# EAGLE board tester (EAGLE 6.6.0)
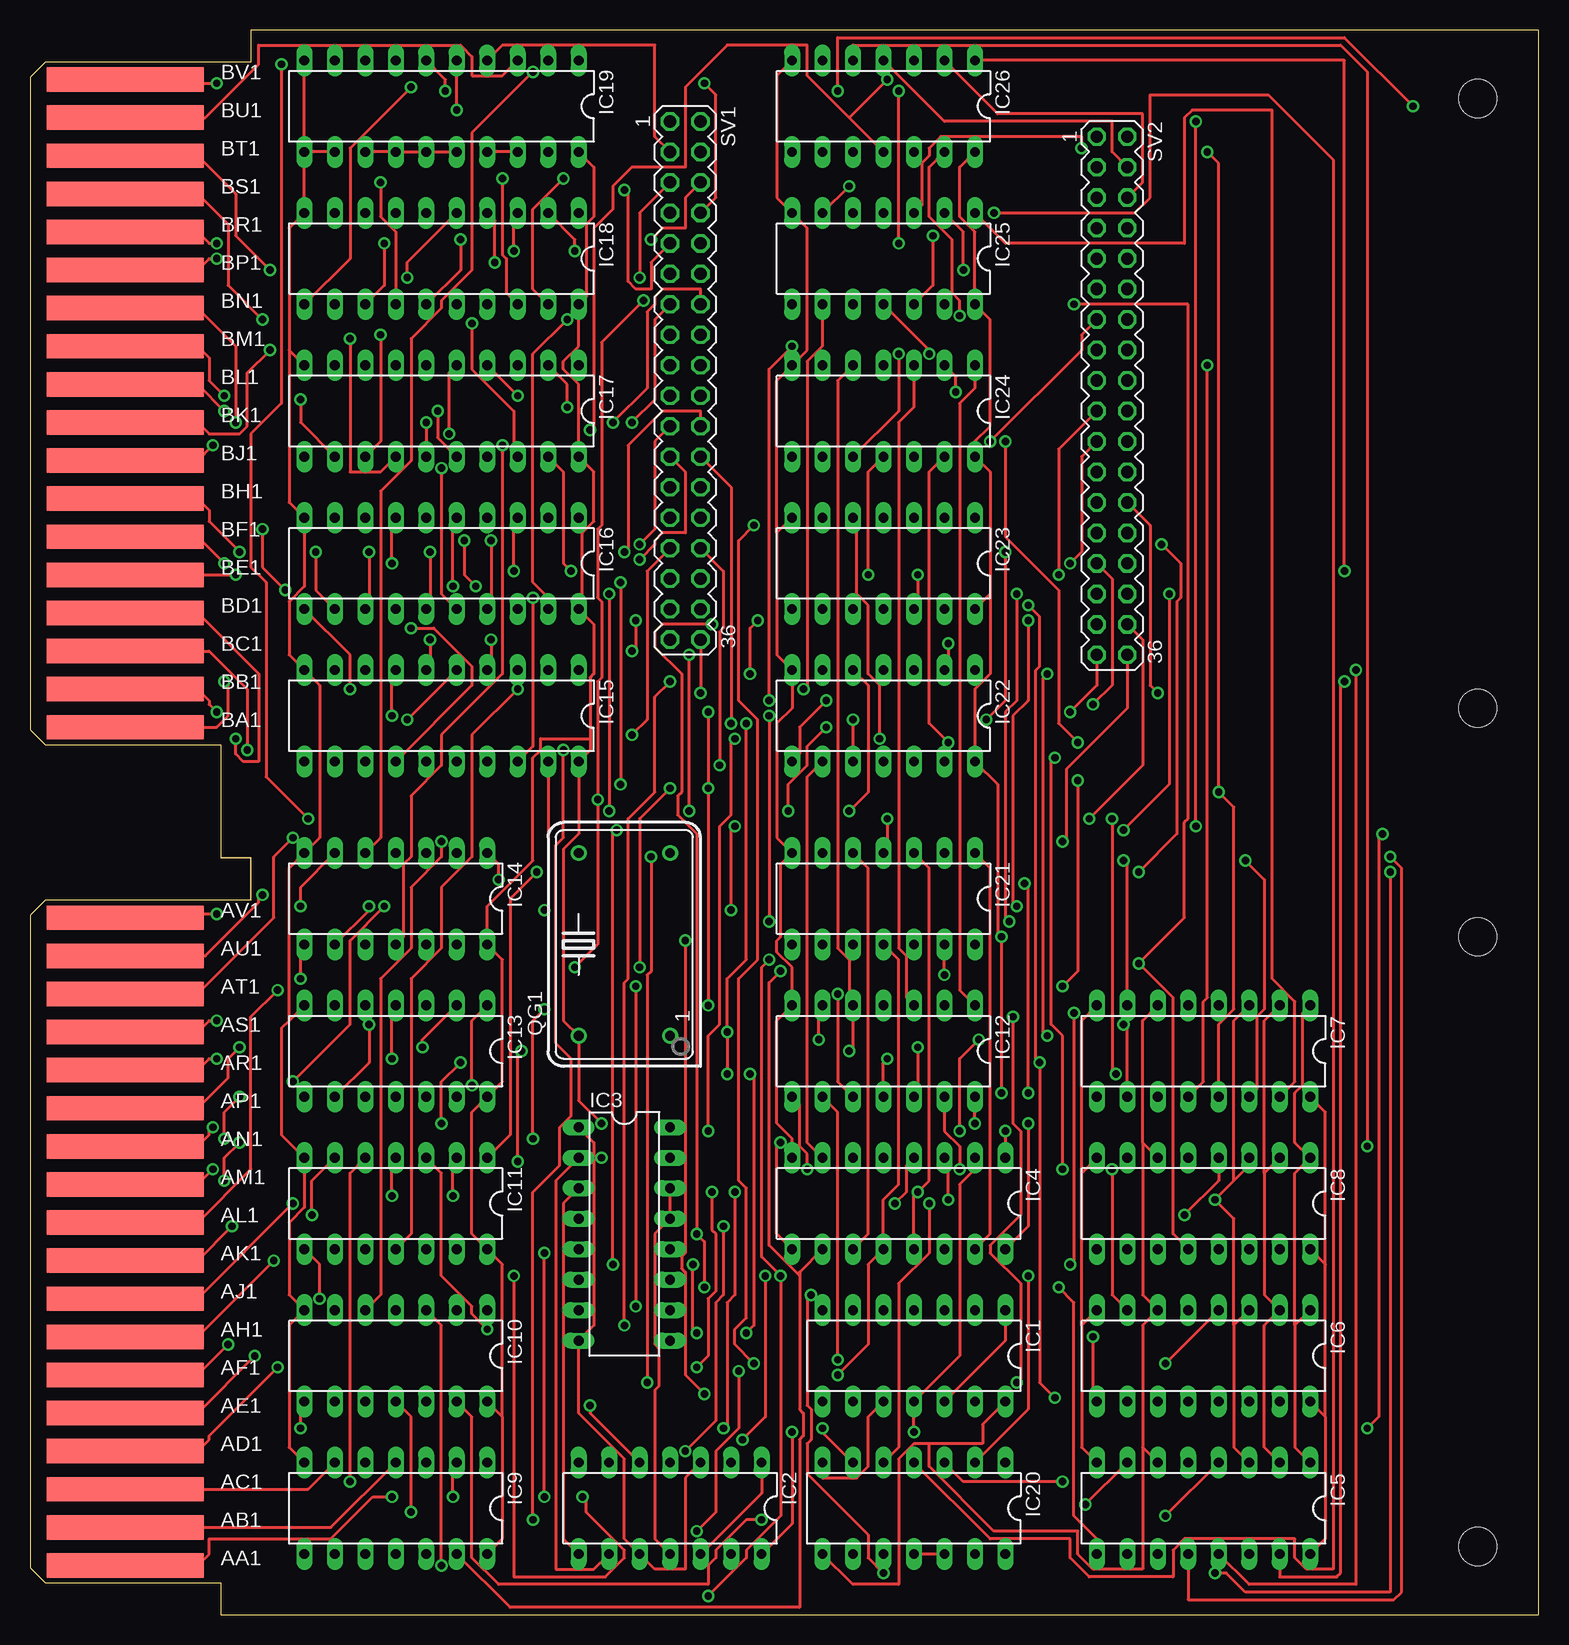
[diagram p1: board, top side]
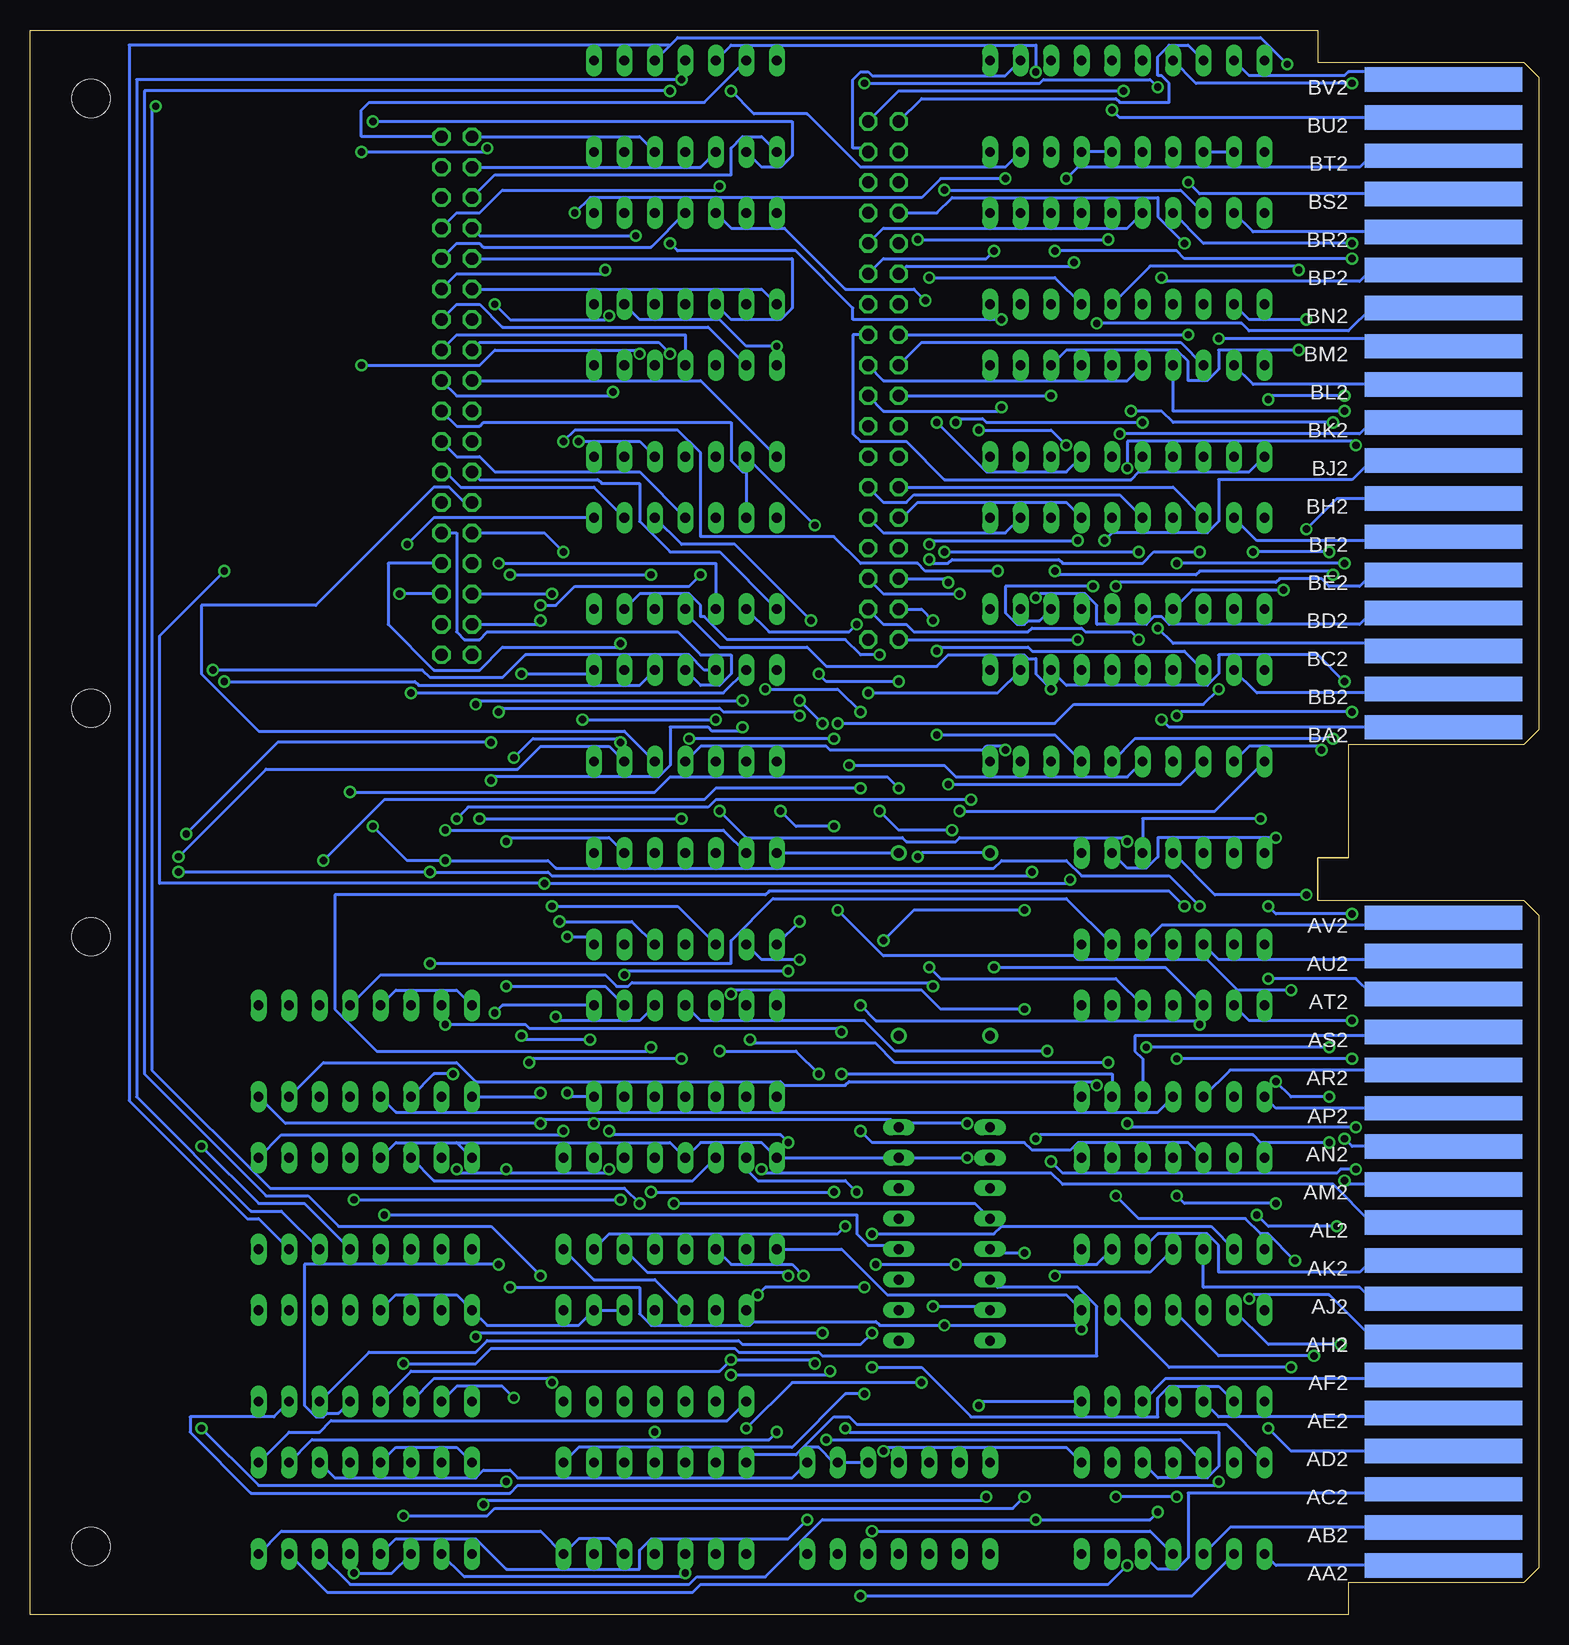
[diagram p2: board, bottom side, seen from below]

Size 125.73 x 132.08 mm. Coordinates in mm from the lower left corner, seen from the top.
Copper layers (1*16): Top 0.035mm / dielectric 1.5mm / Bottom 0.035mm
Design rules "10mils *": minimum track width 10mil, minimum drill 24mil, track to track 10mil, track to pad 10mil, pad to pad 10mil, via to via 10mil, smd to smd 0mil, copper to edge 15mil, drill to drill 10mil, minimum pad ring 10mil, minimum via ring 8mil, stop-mask expansion 0mil, vias tented up to drill 0mil, thermal gap 10mil

## Footprints (pad centres in the part's own frame; a part is rotated, then mirrored left to right if it is on the bottom)
DIL14 = drill 0.813 long: 1 -7.62,-3.81; 2 -5.08,-3.81; 3 -2.54,-3.81; 4 0,-3.81; 5 2.54,-3.81; 6 5.08,-3.81; 7 7.62,-3.81; 8 7.62,3.81; 9 5.08,3.81; 10 2.54,3.81; 11 0,3.81; 12 -2.54,3.81; 13 -5.08,3.81; 14 -7.62,3.81
DIL16 = drill 0.813 long: 1 -8.89,-3.81; 2 -6.35,-3.81; 3 -3.81,-3.81; 4 -1.27,-3.81; 5 1.27,-3.81; 6 3.81,-3.81; 7 6.35,-3.81; 8 8.89,-3.81; 9 8.89,3.81; 10 6.35,3.81; 11 3.81,3.81; 12 1.27,3.81; 13 -1.27,3.81; 14 -3.81,3.81; 15 -6.35,3.81; 16 -8.89,3.81
DIL20 = drill 0.813 long: 1 -11.43,-3.81; 2 -8.89,-3.81; 3 -6.35,-3.81; 4 -3.81,-3.81; 5 -1.27,-3.81; 6 1.27,-3.81; 7 3.81,-3.81; 8 6.35,-3.81; 9 8.89,-3.81; 10 11.43,-3.81; 11 11.43,3.81; 12 8.89,3.81; 13 6.35,3.81; 14 3.81,3.81; 15 1.27,3.81; 16 -1.27,3.81; 17 -3.81,3.81; 18 -6.35,3.81; 19 -8.89,3.81; 20 -11.43,3.81
DIL14S = drill 0.813: 1 -7.62,-3.81; 7 7.62,-3.81; 8 7.62,3.81; 14 -7.62,3.81
MA18-2 = drill 1.016 octagon: 1 -21.59,-1.27; 2 -21.59,1.27; 3 -19.05,-1.27; 4 -19.05,1.27; 5 -16.51,-1.27; 6 -16.51,1.27; 7 -13.97,-1.27; 8 -13.97,1.27; 9 -11.43,-1.27; 10 -11.43,1.27; 11 -8.89,-1.27; 12 -8.89,1.27; 13 -6.35,-1.27; 14 -6.35,1.27; 15 -3.81,-1.27; 16 -3.81,1.27; 17 -1.27,-1.27; 18 -1.27,1.27; 19 1.27,-1.27; 20 1.27,1.27; 21 3.81,-1.27; 22 3.81,1.27; 23 6.35,-1.27; 24 6.35,1.27; 25 8.89,-1.27; 26 8.89,1.27; 27 11.43,-1.27; 28 11.43,1.27; 29 13.97,-1.27; 30 13.97,1.27; 31 16.51,-1.27; 32 16.51,1.27; 33 19.05,-1.27; 34 19.05,1.27; 35 21.59,-1.27; 36 21.59,1.27
EDGE-CON4 = smd 13.106 x 2.032: AA1 7.938,4.128; AB1 7.938,7.303; AC1 7.938,10.477; AD1 7.938,13.652; AE1 7.938,16.828; AF1 7.938,20.003; AH1 7.938,23.177; AJ1 7.938,26.352; AK1 7.938,29.527; AL1 7.938,32.703; AM1 7.938,35.877; AN1 7.938,39.053; AP1 7.938,42.227; AR1 7.938,45.403; AS1 7.938,48.578; AT1 7.938,51.752; AU1 7.938,54.928; AV1 7.938,58.102; BA1 7.938,73.978; BB1 7.938,77.153; BC1 7.938,80.328; BD1 7.938,83.502; BE1 7.938,86.677; BF1 7.938,89.853; BH1 7.938,93.028; BJ1 7.938,96.203; BK1 7.938,99.377; BL1 7.938,102.552; BM1 7.938,105.728; BN1 7.938,108.903; BP1 7.938,112.078; BR1 7.938,115.252; BS1 7.938,118.427; BT1 7.938,121.603; BU1 7.938,124.778; BV1 7.938,127.953 | smd 13.106 x 2.032 bottom: AA2 7.938,4.128; AB2 7.938,7.303; AC2 7.938,10.477; AD2 7.938,13.652; AE2 7.938,16.828; AF2 7.938,20.003; AH2 7.938,23.177; AJ2 7.938,26.352; AK2 7.938,29.527; AL2 7.938,32.703; AM2 7.938,35.877; AN2 7.938,39.053; AP2 7.938,42.227; AR2 7.938,45.403; AS2 7.938,48.578; AT2 7.938,51.752; AU2 7.938,54.928; AV2 7.938,58.102; BA2 7.938,73.978; BB2 7.938,77.153; BC2 7.938,80.328; BD2 7.938,83.502; BE2 7.938,86.677; BF2 7.938,89.853; BH2 7.938,93.028; BJ2 7.938,96.203; BK2 7.938,99.377; BL2 7.938,102.552; BM2 7.938,105.728; BN2 7.938,108.903; BP2 7.938,112.078; BR2 7.938,115.252; BS2 7.938,118.427; BT2 7.938,121.603; BU2 7.938,124.778; BV2 7.938,127.953
DOUBLE = hole 3.175: 120.65,56.515; 120.65,5.715; 120.65,75.565; 120.65,126.365

## Placement (x,y rotation side)
IC1  74LS93N  [DIL14]  73.66,21.59 180 top
IC2  74LS93N  [DIL14]  53.34,8.89 180 top
IC3  74LS139N  [DIL16]  49.53,31.75 270 top
IC4  74LS138N  [DIL16]  72.39,34.29 180 top
IC5  74LS138N  [DIL16]  97.79,8.89 180 top
IC6  74LS138N  [DIL16]  97.79,21.59 180 top
IC7  74LS138N  [DIL16]  97.79,46.99 180 top
IC8  74LS138N  [DIL16]  97.79,34.29 180 top
IC9  74LS07N  [DIL14]  30.48,8.89 180 top
IC10  74LS07N  [DIL14]  30.48,21.59 180 top
IC11  74LS07N  [DIL14]  30.48,34.29 180 top
IC12  74LS07N  [DIL14]  71.12,46.99 180 top
IC13  74LS07N  [DIL14]  30.48,46.99 180 top
IC14  74LS07N  [DIL14]  30.48,59.69 180 top
IC15  74LS682N  [DIL20]  34.29,74.93 180 top
IC16  74LS682N  [DIL20]  34.29,87.63 180 top
IC17  74LS682N  [DIL20]  34.29,100.33 180 top
IC18  74LS682N  [DIL20]  34.29,113.03 180 top
IC19  74LS682N  [DIL20]  34.29,125.73 180 top
IC20  74LS30N  [DIL14]  73.66,8.89 180 top
IC21  74LS07N  [DIL14]  71.12,59.69 180 top
IC22  74LS07N  [DIL14]  71.12,74.93 180 top
IC23  74LS07N  [DIL14]  71.12,87.63 180 top
IC24  74LS07N  [DIL14]  71.12,100.33 180 top
IC25  74LS07N  [DIL14]  71.12,113.03 180 top
IC26  74LS07N  [DIL14]  71.12,125.73 180 top
QG1  [DIL14S]  49.53,55.88 90 top
SV1  [MA18-2]  54.61,102.87 270 top
SV2  [MA18-2]  90.17,101.6 270 top
U$1  [EDGE-CON4]  0,0 0 top
U$2  OUTLINE-DOUBLE  [DOUBLE]  0,0 0 top

## Tracks (layer width: path | path; a pad name or v marks a point on that pad's centre or on a via)
A1  (via drill 0.61)
  Top 0.254: v54.61,13.65 57.15,16.19 57.15,26.04 57.79,26.67 v57.79,32.38 | IC21.1 80.01,62.23 80.01,31.75 IC4.15
  Bottom 0.254: IC9.1 39.37,13.97 54.29,13.97 v54.61,13.65 | v57.79,32.38 58.42,31.75 77.47,31.75 IC4.15
A2  (via drill 0.61)
  Top 0.254: v56.52,1.59 59.69,4.76 59.69,5.4 62.55,8.26 v62.55,28.26 60.96,29.84 60.96,53.98 v61.6,54.61
  Bottom 0.254: IC9.9 28.89,1.59 v56.52,1.59 | v62.55,28.26 62.87,28.57 74.3,28.57 IC4.14 | IC21.9 64.77,54.61 v61.6,54.61
AA1  (via drill 0.61)
  Top 0.254: IC9.2 35.24,12.38 v35.24,9.84 | v30.16,9.84 28.58,9.84 25.08,6.35 14.92,6.35 14.92,5.08 13.97,4.13 U$1.AA1
  Bottom 0.254: v30.16,9.84 v35.24,9.84
AA2
  Bottom 0.254: IC9.8 21.91,4.13 U$1.AA2
AB1
  Top 0.254: IC9.4 25.08,7.3 U$1.AB1
AB2
  Bottom 0.254: IC9.10 25.72,7.3 U$1.AB2
AC1
  Top 0.254: IC9.6 23.18,10.48 U$1.AC1
AC2
  Bottom 0.254: IC9.12 31.75,3.81 30.16,3.81 29.21,4.76 29.21,10.16 8.26,10.16 U$1.AC2
AD1  (via drill 0.61)
  Top 0.254: v20.64,20.64 14.92,14.92 14.92,14.61 13.97,13.65 U$1.AD1
  Bottom 0.254: IC10.2 30.8,20.64 v20.64,20.64
AD2  (via drill 0.61)
  Top 0.254: IC10.8 22.54,17.46 v22.54,15.56
  Bottom 0.254: v22.54,15.56 20.64,13.65 U$1.AD2
ADD0  (via drill 0.61)
  Top 0.254: v81.28,40.32 IC4.1 | IC7.1 106.05,50.16 106.05,44.13 105.41,43.5 105.41,39.37 IC8.1 105.41,36.83 105.41,24.13 | IC5.1 105.41,13.97 105.41,24.13 | IC6.1 105.41,24.13
  Bottom 0.254: v81.28,40.32 81.6,40.01 104.78,40.01 IC8.1 | IC1.8 67.63,16.19 100.65,16.19 101.6,15.24 104.14,15.24 IC5.1
ADD1  (via drill 0.61)
  Top 0.254: 102.87,36.83 102.87,26.67 IC6.2 102.87,24.13 102.87,13.97 IC5.2 | IC8.2 102.87,36.83 | IC7.2 102.87,49.53 102.87,36.83 | IC4.2 78.74,37.15 77.47,35.88 77.47,21.59 IC1.11 v73.66,15.24 | IC2.14 63.5,7.62 v63.5,15.24
  Bottom 0.254: v63.5,15.24 64.14,14.61 73.66,14.61 | 73.66,14.61 102.24,14.61 IC5.2 | 73.66,14.61 v73.66,15.24
ADD2  (via drill 0.61)
  Top 0.254: IC4.3 76.52,37.78 v76.52,34.61 | 100.33,36.2 101.6,37.47 IC8.3 | 100.33,36.2 v98.74,34.61 100.33,33.02 100.33,24.13 | IC7.3 100.33,49.53 100.33,36.2 | IC2.12 60.96,10.16 IC2.1 | IC5.3 100.33,13.97 100.33,24.13 | IC6.3 100.33,24.13
  Bottom 0.254: v98.74,34.61 v76.52,34.61 | IC2.1 62.23,11.43 85.09,11.43 85.73,12.06 87.95,12.06 88.58,11.43 100.33,11.43 IC5.3
ADD3
  Top 0.254: IC2.9 46.99,3.81 43.82,3.81 43.82,36.2 IC3.2
ADD4
  Top 0.254: IC2.8 44.45,6.35 44.45,34.29 IC3.3
ADD5
  Top 0.254: IC2.11 52.07,6.35 52.07,18.73 52.39,19.05 52.39,22.23 52.07,22.54 52.07,31.75 IC3.13 IC3.14
AE1  (via drill 0.61)
  Top 0.254: v18.73,21.59 13.97,16.83 U$1.AE1
  Bottom 0.254: IC10.4 26.67,21.59 v18.73,21.59
AE2
  Bottom 0.254: IC10.10 26.67,16.51 8.26,16.51 U$1.AE2
AF1  (via drill 0.61)
  Top 0.254: v16.51,22.54 13.97,20 U$1.AF1
  Bottom 0.254: IC10.6 22.54,22.54 v16.51,22.54
AF2
  Bottom 0.254: IC10.12 31.12,19.68 8.26,19.68 U$1.AF2
AH1  (via drill 0.61)
  Top 0.254: IC11.2 35.24,37.78 v35.24,34.92 | v20.32,29.53 13.97,23.18 U$1.AH1
  Bottom 0.254: v35.24,34.92 33.34,33.02 24.45,33.02 23.18,31.75 22.54,31.75 v20.32,29.53
AH2  (via drill 0.61)
  Top 0.254: IC11.8 24.13,29.21 v24.13,26.35
  Bottom 0.254: v24.13,26.35 23.81,26.67 17.46,26.67 13.97,23.18 U$1.AH2
AJ1  (via drill 0.61)
  Top 0.254: IC11.4 30.16,37.78 v30.16,34.92 | v21.91,34.29 13.97,26.35 U$1.AJ1
  Bottom 0.254: v30.16,34.92 29.53,34.29 v21.91,34.29
AJ2
  Bottom 0.254: IC11.10 27.94,27.3 14.92,27.3 13.97,26.35 U$1.AJ2
AK1  (via drill 0.61)
  Top 0.254: IC11.6 23.5,36.2 v23.5,33.34 | v16.83,32.38 13.97,29.53 U$1.AK1
  Bottom 0.254: v23.5,33.34 22.54,32.38 v16.83,32.38
AK2
  Bottom 0.254: IC11.12 31.75,31.75 27.62,31.75 26.67,30.8 26.67,28.57 14.92,28.57 13.97,29.53 U$1.AK2
AL1  (via drill 0.61)
  Top 0.254: v86.04,52.39 87.31,53.66 v87.31,69.53 | v66.36,73.98 64.77,72.39 64.77,70.8 63.18,69.22 v63.18,66.99 | v58.74,65.72 58.42,65.41 v58.42,58.74 | v20.64,52.07 18.42,49.85 18.42,37.15 13.97,32.7 U$1.AL1
  Bottom 0.254: IC12.2 77.79,52.39 v86.04,52.39 | v87.31,69.53 87,69.85 73.34,69.85 72.39,70.8 72.39,73.98 69.22,73.98 68.9,73.66 66.68,73.66 v66.36,73.98 | v63.18,66.99 61.91,65.72 v58.74,65.72 | v58.42,58.74 54.61,54.93 38.74,54.93 38.42,54.61 27.62,54.61 25.08,52.07 v20.64,52.07
AL2  (via drill 0.61)
  Top 0.254: IC12.8 64.14,42.55 64.14,39.05 64.77,38.42 v64.77,37.15
  Bottom 0.254: v64.77,37.15 64.45,36.83 40.64,36.83 39.69,35.88 17.15,35.88 13.97,32.7 U$1.AL2
AM1  (via drill 0.61)
  Top 0.254: v40.96,46.99 40.64,46.67 v40.64,37.78 | v15.24,37.15 13.97,35.88 U$1.AM1
  Bottom 0.254: IC12.4 69.85,49.53 56.2,49.53 53.66,46.99 v40.96,46.99 | v40.64,37.78 39.69,36.83 16.83,36.83 16.51,37.15 v15.24,37.15
AM2  (via drill 0.61)
  Top 0.254: IC12.10 67.31,44.45 v67.31,51.75 | v42.86,50.48 41.91,49.53 v41.91,39.69 | v17.46,39.37 16.19,38.1 v16.19,36.2
  Bottom 0.254: v67.31,51.75 66.99,52.07 51.44,52.07 49.85,50.48 v42.86,50.48 | v41.91,39.69 41.59,40.01 23.81,40.01 23.18,39.37 v17.46,39.37 | v16.19,36.2 15.88,35.88 U$1.AM2
AN1  (via drill 0.61)
  Top 0.254: IC12.6 65.72,50.48 v65.72,47.94 | v35.88,46.04 34.29,44.45 v34.29,40.96 | v15.24,40.64 14.92,40.32 14.92,40.01 13.97,39.05 U$1.AN1
  Bottom 0.254: v65.72,47.94 65.41,47.62 55.25,47.62 53.66,46.04 v35.88,46.04 | v34.29,40.96 33.97,40.64 v15.24,40.64
AN2  (via drill 0.61)
  Top 0.254: IC12.12 73.98,43.5 v73.98,47.31 | v29.53,59.05 26.67,56.2 26.67,49.21 v21.91,44.45 | v17.46,43.18 16.19,41.91 v16.19,39.69
  Bottom 0.254: v73.98,47.31 74.3,46.99 96.84,46.99 100.33,50.48 100.33,60.01 64.45,60.01 64.14,60.33 30.8,60.33 v29.53,59.05 | v21.91,44.45 20.64,43.18 v17.46,43.18 | v16.19,39.69 15.56,39.05 U$1.AN2
AP1  (via drill 0.61)
  Top 0.254: IC13.2 32.7,47.94 v32.7,47.31 | v17.46,47.31 16.51,46.35 16.51,44.77 13.97,42.23 U$1.AP1
  Bottom 0.254: v17.46,47.31 v32.7,47.31
AP2
  Bottom 0.254: IC13.8 21.91,42.23 U$1.AP2
AR1  (via drill 0.61)
  Top 0.254: IC13.4 30.16,50.48 v30.16,46.35 | v15.56,46.35 14.92,46.35 13.97,45.4 U$1.AR1
  Bottom 0.254: v15.56,46.35 v30.16,46.35
AR2
  Bottom 0.254: IC13.10 25.72,45.4 U$1.AR2
AS1  (via drill 0.61)
  Top 0.254: v15.56,49.53 14.92,49.53 13.97,48.58 U$1.AS1
  Bottom 0.254: IC13.6 24.13,49.53 v15.56,49.53
AS2
  Bottom 0.254: IC13.12 33.02,46.35 33.66,46.99 33.66,48.26 8.26,48.26 U$1.AS2
AT1  (via drill 0.61)
  Top 0.254: v21.91,64.77 20.32,63.18 20.32,58.1 13.97,51.75 U$1.AT1
  Bottom 0.254: IC14.2 34.29,62.23 32.7,62.23 31.75,63.18 31.75,64.77 v21.91,64.77
AT2  (via drill 0.61)
  Top 0.254: IC14.8 22.54,55.56 v22.54,53.02
  Bottom 0.254: v22.54,53.02 15.24,53.02 13.97,51.75 U$1.AT2
AU1  (via drill 0.61)
  Top 0.254: v19.37,60.01 19.05,59.69 19.05,59.37 14.61,54.93 U$1.AU1
  Bottom 0.254: IC14.4 26.99,60.01 v19.37,60.01
AU2
  Bottom 0.254: IC14.10 26.67,54.61 8.26,54.61 U$1.AU2
AV1  (via drill 0.61)
  Top 0.254: IC14.6 22.54,60.64 v22.54,59.05 | v15.56,58.42 7.94,58.42 U$1.AV1
  Bottom 0.254: v22.54,59.05 21.91,58.42 v15.56,58.42
AV2
  Bottom 0.254: IC14.12 31.43,57.47 8.57,57.47 U$1.AV2
B1  (via drill 0.61)
  Top 0.254: v57.79,15.56 58.1,15.88 58.1,26.04 58.74,26.67 v58.74,35.24 | IC4.13 73.66,34.92 v73.98,35.24 74.93,36.2 74.93,62.23 IC21.3
  Bottom 0.254: IC9.3 31.75,11.43 27.62,11.43 26.67,12.38 26.67,15.24 57.47,15.24 v57.79,15.56 | v73.98,35.24 v58.74,35.24
B2  (via drill 0.61)
  Top 0.254: v55.56,6.99 57.15,8.57 57.15,13.65 59.06,15.56 v59.06,20.32 | v67.31,20 69.85,22.54 69.85,29.21 IC4.12 71.12,34.61 72.39,35.88 72.39,54.61 IC21.11
  Bottom 0.254: IC9.11 32.39,6.99 v55.56,6.99 | v59.06,20.32 59.37,20 v67.31,20
BA1  (via drill 0.61)
  Top 0.254: v16.19,77.79 16.51,77.47 16.51,74.93 15.56,73.98 U$1.BA1
  Bottom 0.254: IC15.3 39.37,77.47 27.62,77.47 26.67,78.42 26.67,80.01 18.42,80.01 v16.19,77.79
BA2  (via drill 0.61)
  Top 0.254: v31.43,74.61 IC15.5
  Bottom 0.254: v31.43,74.61 30.8,73.98 U$1.BA2
BB1  (via drill 0.61)
  Top 0.254: IC15.7 30.16,78.42 v30.16,74.93 | v15.56,75.25 14.92,75.88 14.92,76.2 13.97,77.15 U$1.BB1
  Bottom 0.254: v30.16,74.93 29.85,75.25 v15.56,75.25
BB2
  Bottom 0.254: IC15.9 23.5,76.83 8.26,76.83 U$1.BB2
BC1  (via drill 0.61)
  Top 0.254: v18.1,72.07 18.1,77.15 14.92,80.33 U$1.BC1
  Bottom 0.254: IC15.12 24.13,72.39 18.42,72.39 v18.1,72.07
BC2  (via drill 0.61)
  Top 0.254: IC15.14 36.83,77.47 36.83,79.06 33.66,82.23 v31.75,82.23
  Bottom 0.254: v31.75,82.23 30.48,80.96 8.57,80.96 U$1.BC2
BD1  (via drill 0.61)
  Top 0.254: v17.15,73.03 17.15,71.75 17.78,71.12 19.05,71.12 19.05,78.42 13.97,83.5 U$1.BD1
  Bottom 0.254: IC15.16 33.66,73.03 v17.15,73.03
BD2  (via drill 0.61)
  Top 0.254: IC15.18 41.91,72.39 v41.91,84.77
  Bottom 0.254: v41.91,84.77 41.59,85.09 37.78,85.09 36.83,84.14 36.83,82.55 32.7,82.55 32.07,83.19 31.43,83.19 30.8,82.55 14.92,82.55 13.97,83.5 U$1.BD2
BE1  (via drill 0.61)
  Top 0.254: IC16.3 40.32,91.12 v40.32,87 | U$1.BE1 v17.15,86.68
  Bottom 0.254: v40.32,87 40.01,86.68 28.58,86.68 28.26,87 17.46,87 v17.15,86.68
BE2  (via drill 0.61)
  Top 0.254: IC16.5 35.24,91.12 v35.24,85.72
  Bottom 0.254: v35.24,85.72 34.93,86.04 21.91,86.04 21.59,86.36 18.1,86.36 17.46,85.72 14.92,85.72 13.97,86.68 U$1.BE2
BF1  (via drill 0.61)
  Top 0.254: IC16.7 30.16,91.12 v30.16,87.63 | v16.19,87.63 13.97,89.85 U$1.BF1
  Bottom 0.254: v16.19,87.63 v30.16,87.63
BF2
  Bottom 0.254: IC16.9 23.5,89.53 8.26,89.53 U$1.BF2
BH1  (via drill 0.61)
  Top 0.254: IC16.12 23.81,85.41 v23.81,88.58 | v17.46,88.58 14.92,91.12 14.92,92.08 13.97,93.03 U$1.BH1
  Bottom 0.254: v17.46,88.58 v23.81,88.58
BH2  (via drill 0.61)
  Top 0.254: v21.27,85.41 19.37,87.31 v19.37,90.49
  Bottom 0.254: IC16.14 28.89,85.41 v21.27,85.41 | v19.37,90.49 16.83,93.03 U$1.BH2
BJ1  (via drill 0.61)
  Top 0.254: IC16.16 34.29,85.09 v34.29,95.57 | v15.24,97.47 13.97,96.2 U$1.BJ1
  Bottom 0.254: v34.29,95.57 34.29,97.79 15.56,97.79 v15.24,97.47
BJ2  (via drill 0.61)
  Top 0.254: v37.15,85.72 36.2,86.68 v36.2,89.53
  Bottom 0.254: IC16.18 41.59,82.87 42.55,82.87 42.86,82.55 43.5,82.55 44.45,83.5 44.45,85.72 v37.15,85.72 | v36.2,89.53 35.56,90.17 27.62,90.17 26.67,91.12 26.67,94.61 15.56,94.61 13.97,96.2 U$1.BJ2
BK1  (via drill 0.61)
  Top 0.254: v20,105.41 18.1,103.5 18.1,99.06 17.46,98.42 14.92,98.42 13.97,99.38 U$1.BK1
  Bottom 0.254: IC17.3 39.37,105.41 30.16,105.41 29.21,104.46 29.21,102.87 27.62,102.87 26.67,103.82 26.67,105.41 v20,105.41
BK2  (via drill 0.61)
  Top 0.254: IC17.5 34.93,103.5 v34.93,98.42
  Bottom 0.254: v34.93,98.42 14.92,98.42 13.97,99.38 U$1.BK2
BL1  (via drill 0.61)
  Top 0.254: v16.19,100.33 13.97,102.55 U$1.BL1
  Bottom 0.254: IC17.7 30.48,100.33 v16.19,100.33
BL2
  Bottom 0.254: IC17.9 23.81,102.55 U$1.BL2
BM1  (via drill 0.61)
  Top 0.254: IC17.12 22.54,99.38 v22.54,101.28 | v16.19,101.6 14.92,102.87 14.92,104.78 13.97,105.73 U$1.BM1
  Bottom 0.254: v22.54,101.28 22.23,101.6 v16.19,101.6
BM2  (via drill 0.61)
  Top 0.254: IC17.14 29.21,95.25 26.67,95.25 v26.67,106.36
  Bottom 0.254: v26.67,106.36 8.57,106.36 U$1.BM2
BN1  (via drill 0.61)
  Top 0.254: IC17.16 33.97,98.11 v33.97,100.33 | v17.15,99.38 17.15,105.73 13.97,108.9 U$1.BN1
  Bottom 0.254: v33.97,100.33 31.43,100.33 30.48,99.38 v17.15,99.38
BN2  (via drill 0.61)
  Top 0.254: IC17.18 40.32,96.84 40.32,100.33 36.83,103.82 v36.83,107.63
  Bottom 0.254: v36.83,107.63 24.77,107.63 24.13,107 15.88,107 13.97,108.9 U$1.BN2
BP1  (via drill 0.61)
  Top 0.254: IC18.3 40.32,116.52 v40.32,113.67 | v15.56,113.03 14.92,113.03 13.97,112.08 U$1.BP1
  Bottom 0.254: v40.32,113.67 30.16,113.67 29.53,113.03 v15.56,113.03
BP2  (via drill 0.61)
  Top 0.254: IC18.5 31.43,112.71 v31.43,111.44
  Bottom 0.254: v31.43,111.44 31.12,111.12 14.92,111.12 13.97,112.08 U$1.BP2
BR1  (via drill 0.61)
  Top 0.254: v15.56,114.3 14.92,114.3 13.97,115.25 U$1.BR1
  Bottom 0.254: IC18.7 27.94,114.3 v15.56,114.3
BR2
  Bottom 0.254: IC18.9 23.81,115.25 U$1.BR2
BS1  (via drill 0.61)
  Top 0.254: v19.37,107.95 16.51,110.81 16.51,115.89 13.97,118.43 U$1.BS1
  Bottom 0.254: IC18.12 24.13,107.95 v19.37,107.95
BS2  (via drill 0.61)
  Top 0.254: IC18.14 30.48,115.25 29.21,116.52 v29.21,119.38
  Bottom 0.254: v29.21,119.38 28.26,118.43 U$1.BS2
BT1  (via drill 0.61)
  Top 0.254: v20,112.08 17.15,114.94 17.15,118.43 13.97,121.6 U$1.BT1
  Bottom 0.254: IC18.16 32.39,112.39 20.32,112.39 v20,112.08
BT2  (via drill 0.61)
  Top 0.254: IC18.18 39.69,110.17 39.69,113.03 39.37,113.35 v39.37,119.7
  Bottom 0.254: v39.37,119.7 38.42,120.65 14.92,120.65 13.97,121.6 U$1.BT2
BU1
  Top 0.254: IC19.3 39.37,128.27 36.83,128.27 36.83,129.86 35.88,130.81 19.05,130.81 19.05,129.22 14.61,124.78 U$1.BU1
BU2  (via drill 0.61)
  Top 0.254: v35.56,125.41 IC19.5
  Bottom 0.254: v35.56,125.41 34.93,124.78 U$1.BU2
BV1  (via drill 0.61)
  Top 0.254: v15.56,127.64 7.94,127.64 U$1.BV1
  Bottom 0.254: IC19.7 28.58,127.64 v15.56,127.64
BV2
  Bottom 0.254: IC19.9 24.13,128.27 16.19,128.27 15.88,128.59 8.57,128.59 U$1.BV2
C1  (via drill 0.61)
  Top 0.254: v59.37,14.61 61.28,16.51 v61.28,28.26 | IC21.5 69.85,62.23 69.85,31.75 IC4.11
  Bottom 0.254: IC9.5 29.85,14.61 v59.37,14.61 | v61.28,28.26 62.23,29.21 67.31,29.21 IC4.11
C2  (via drill 0.61)
  Top 0.254: IC9.13 40.01,0.64 64.14,0.64 64.14,14.61 64.45,14.92 64.45,16.83 64.14,17.14 64.14,28.26 | 64.14,28.26 64.14,28.57 IC4.10 | v76.2,53.34 IC21.13 | v62.55,53.66 61.6,52.7 61.6,30.8 64.14,28.26
  Bottom 0.254: v76.2,53.34 75.88,53.66 v62.55,53.66
CLK1
  Top 0.254: IC1.12 81.28,22.86 IC1.1
D1  (via drill 0.61)
  Top 0.254: v84.77,78.42 84.46,78.11 84.46,48.58 v84.77,48.26 | v79.06,47.94 77.47,46.35 v77.47,40.32 | v62.55,39.37 62.23,39.05 62.23,31.75 IC4.9
  Bottom 0.254: IC10.1 39.37,26.67 54.29,26.67 58.1,30.48 IC4.9 | IC22.1 79.06,78.42 v84.77,78.42 | v84.77,48.26 84.46,47.94 v79.06,47.94 | v77.47,40.32 77.15,40.01 63.18,40.01 v62.55,39.37
D2  (via drill 0.61)
  Top 0.254: v55.56,20.64 56.52,21.59 56.52,26.35 57.15,26.99 57.15,31.75 56.83,32.07 v56.83,35.24 | IC22.9 64.77,69.85 64.77,39.37 IC4.7
  Bottom 0.254: IC10.9 26.67,19.05 30.8,19.05 31.75,18.1 31.75,16.51 47.31,16.51 51.44,20.64 v55.56,20.64 | v56.83,35.24 57.79,36.2 65.09,36.2 66.04,37.15 IC4.7
E1  (via drill 0.61)
  Top 0.254: IC10.3 34.29,24.13 v34.29,4.13 | v109.54,77.79 109.22,77.47 109.22,3.49 108.9,3.17 104.14,3.17 IC5.15
  Bottom 0.254: v34.29,4.13 35.88,2.54 69.85,2.54 70.49,1.91 100.97,1.91 IC5.15 | IC22.3 74.93,77.47 93.35,77.47 93.66,77.79 v109.54,77.79
E2  (via drill 0.61)
  Top 0.254: IC10.11 31.75,16.51 v31.75,8.57 | v44.45,72.07 44.45,64.77 43.82,64.14 43.82,47.62 45.09,46.35 45.09,41.59 44.13,40.64 44.13,37.47 41.91,35.24 v41.91,7.94
  Bottom 0.254: v31.75,8.57 32.39,7.94 v41.91,7.94 59.69,7.94 64.45,3.17 70.17,3.17 70.8,2.54 99.06,2.54 IC5.14 | IC22.11 69.85,72.39 59.37,72.39 59.06,72.07 46.36,72.07 46.04,72.39 44.77,72.39 v44.45,72.07
F1  (via drill 0.61)
  Top 0.254: IC10.5 29.21,26.67 29.21,53.02 31.75,55.56 31.75,60.64 34.29,63.18 v34.29,64.45 | v68.26,66.99 69.85,68.58 69.85,77.47 IC22.5 | IC5.13 101.6,2.54 110.49,2.54 v110.49,78.74
  Bottom 0.254: v34.29,64.45 34.61,64.77 48.26,64.77 48.58,64.45 52.71,64.45 53.02,64.77 66.04,64.77 v68.26,66.99 | v110.49,78.74 93.03,78.74 92.39,78.11 86.36,78.11 84.46,80.01 70.8,80.01 69.53,78.74 IC22.5
F2  (via drill 0.61)
  Top 0.254: IC10.13 36.83,16.51 36.83,4.76 39.05,2.54 56.52,2.54 56.52,4.13 57.15,4.76 57.15,5.4 59.69,7.94 v60.96,7.94 | v113.35,63.18 114.3,62.23 114.3,1.91 113.67,1.27 96.52,1.27 IC5.12
  Bottom 0.254: v60.96,7.94 62.55,6.35 73.98,6.35 74.93,5.4 74.93,3.81 86.04,3.81 88.58,6.35 95.25,6.35 IC5.12 | IC22.13 77.47,72.39 83.19,72.39 85.09,70.48 106.05,70.48 v113.35,63.18
GND  (via drill 0.61)
  Top 0.254: IC9.7 21.59,13.97 21.59,24.13 IC10.7 21.59,26.67 21.59,32.7 22.86,33.97 IC11.7 20.96,40.01 20.96,48.9 21.59,49.53 | IC13.7 21.59,49.53 | 21.59,49.53 21.59,62.23 IC14.7 24.13,64.77 24.13,77.47 IC15.10 21.59,80.01 21.59,84.45 22.86,85.72 IC16.10 21.59,92.71 21.59,105.41 | IC19.12 IC19.11 | IC19.11 IC19.10 | IC19.18 IC19.17 | IC19.13 IC19.14 IC19.15 IC19.16 | 21.59,105.41 IC17.10 | 21.59,105.41 21.59,115.57 IC18.10 IC19.11 | IC26.7 62.23,128.27 62.23,118.11 IC25.7 64.77,115.57 64.77,105.41 IC24.7 62.23,102.87 62.23,90.17 | 62.23,90.17 62.23,80.01 IC22.7 63.5,75.56 62.23,74.3 62.23,64.77 IC21.7 62.55,62.55 62.55,56.52 62.23,56.2 62.23,55.24 63.5,53.98 IC12.7 62.23,49.53 62.23,40.96 63.5,39.69 IC4.8 | IC23.7 62.23,90.17 | 46.99,38.1 46.99,39.37 IC3.1 | 46.99,38.1 46.99,24.13 IC3.8 45.72,16.83 49.53,13.02 49.53,6.35 IC2.10 52.07,3.81 54.61,3.81 54.61,11.43 IC2.3 | IC1.10 69.85,16.51 69.85,12.38 68.9,11.43 66.04,11.43 IC20.7 | IC5.8 87.63,13.97 87.63,24.13 | IC6.8 87.63,24.13 | 87.63,36.83 IC8.8 | 87.63,24.13 87.63,36.83 | IC7.8 87.63,49.53 87.63,36.83 | v47.63,38.1 46.99,38.1
  Bottom 0.254: IC19.16 IC19.17 | IC19.13 IC19.12 | IC21.7 QG1.7 | IC2.3 IC2.2 58.74,12.7 60.01,13.97 61.28,13.97 | IC20.7 65.41,13.34 61.91,13.34 61.28,13.97 | IC7.8 90.17,52.07 95.25,52.07 IC7.5 | 90.17,39.37 IC8.8 | 90.17,39.37 95.25,39.37 IC8.5 | IC5.8 90.17,13.97 95.25,13.97 IC5.5 | IC1.3 IC1.2 80.01,24.13 87.63,24.13 IC6.8 90.17,26.67 95.25,26.67 IC6.5 | 90.17,39.37 72.39,39.37 IC4.5 69.85,39.37 64.77,39.37 IC4.8 IC3.15 v47.63,38.1 | IC9.7 26.04,15.88 56.83,15.88 57.47,16.51 58.74,16.51 61.28,13.97
H1  (via drill 0.61)
  Top 0.254: IC11.1 40.01,40.01 40.01,59.69 v42.23,61.91 | v92.39,61.91 95.57,65.09 95.57,84.45 95.89,84.77 95.89,87.63 v94.3,89.22 | v98.74,3.49 99.7,3.49 101.28,1.91 113.35,1.91 v113.35,61.91
  Bottom 0.254: v42.23,61.91 42.55,61.59 82.23,61.59 82.55,61.91 v92.39,61.91 v113.35,61.91 | v94.3,89.22 92.08,91.44 IC23.1 | IC5.11 95.57,3.49 v98.74,3.49
H2  (via drill 0.61)
  Top 0.254: v56.83,82.55 52.71,82.55 52.07,81.92 52.07,80.64 54.29,78.42 54.29,68.58 53.98,68.26 53.98,66.67 55.56,65.09 v55.56,31.75 56.2,31.11 v56.2,27.3 | v71.12,3.49 69.85,4.76 69.85,6.67 64.77,11.75 64.77,14.29 65.09,14.61 65.09,17.14 64.77,17.46 64.77,26.35 v65.09,26.67
  Bottom 0.254: IC11.9 27.31,32.38 44.77,32.38 45.4,31.75 v55.56,31.75 | v56.83,82.55 57.47,81.92 64.14,81.92 IC23.9 | IC5.10 89.54,3.17 71.44,3.17 v71.12,3.49 | v65.09,26.67 64.45,27.3 v56.2,27.3
J1  (via drill 0.61)
  Top 0.254: IC11.3 34.29,36.83 34.29,28.26 36.83,25.72 36.83,25.08 v38.1,23.81 | v85.73,27.3 87,26.04 87,8.26 88.9,6.35 IC5.9 | v60.64,82.87 60.01,82.23 v60.01,78.42 | v53.34,77.79 52.07,76.52 52.07,68.58 49.85,66.36 49.85,53.02 49.53,52.7 v49.53,24.13
  Bottom 0.254: v38.1,23.81 38.42,24.13 v49.53,24.13 54.93,24.13 55.25,24.45 65.41,24.45 65.72,24.13 73.98,24.13 74.93,25.08 74.93,27.3 v85.73,27.3 | IC23.3 71.44,89.22 66.99,89.22 v60.64,82.87 | v60.01,78.42 59.37,77.79 v53.34,77.79
J2  (via drill 0.61)
  Top 0.254: IC11.11 31.75,31.75 31.75,53.02 34.29,55.56 34.29,60.64 36.83,63.18 36.83,73.34 v40.64,77.15 | v87.95,9.21 IC5.7 | v46.04,9.84 46.36,9.53 46.36,8.57 49.53,5.4 49.53,4.76 47.94,3.17 40.32,3.17 v40.32,28.26
  Bottom 0.254: v40.64,77.15 41.91,78.42 41.91,79.69 42.55,79.69 42.86,80.01 49.21,80.01 50.17,79.06 59.37,79.06 60.96,80.64 68.26,80.64 71.12,83.5 IC23.11 | v87.95,9.21 87.63,9.53 46.36,9.53 v46.04,9.84 | v40.32,28.26 40.01,28.57 32.39,28.57 IC11.11
K1  (via drill 0.61)
  Top 0.254: IC11.5 26.67,36.83 v26.67,11.11 | IC23.5 68.9,91.12 68.9,85.09 69.85,84.14 69.85,78.42 70.8,77.47 v70.8,73.03 | v58.74,73.03 58.42,72.71 58.42,66.67 57.47,65.72 57.47,49.21 56.52,48.26 v56.52,40.32
  Bottom 0.254: v26.67,11.11 26.99,10.79 85.09,10.79 85.73,10.16 107.32,10.16 112.4,15.24 112.4,16.51 105.41,16.51 IC6.15 | v58.74,73.03 v70.8,73.03 | v56.52,40.32 55.56,39.37 42.86,39.37 42.23,38.73 39.05,38.73 38.42,39.37 29.21,39.37 IC11.5
K2  (via drill 0.61)
  Top 0.254: v55.25,29.21 55.25,23.81 v55.56,23.5 | v54.93,66.99 v54.93,80.01 | v48.9,65.41 48.58,65.09 v48.58,29.21
  Bottom 0.254: IC11.13 36.83,29.21 v48.58,29.21 v55.25,29.21 | v55.56,23.5 56.52,22.54 66.36,22.54 66.68,22.86 87.63,22.86 88.58,21.91 97.47,21.91 IC6.14 | IC23.13 74.93,85.09 70.8,85.09 69.85,84.14 69.85,83.19 69.53,83.19 67.63,81.28 57.79,81.28 56.52,80.01 v54.93,80.01 | v54.93,66.99 53.34,65.41 v48.9,65.41
L1  (via drill 0.61)
  Top 0.254: IC12.1 77.47,52.07 77.47,100.97 78.74,102.23 IC24.1 | v86.68,29.21 87,29.53 v87,50.16
  Bottom 0.254: IC6.13 100.01,16.83 100.97,16.83 101.28,16.51 101.92,16.51 102.87,17.46 102.87,29.21 v86.68,29.21 | v87,50.16 86.36,50.8 IC12.1
L2  (via drill 0.61)
  Top 0.254: IC12.9 67.31,41.91 v67.31,21.27 | v60.33,90.81 59.06,89.53 59.06,76.2 60.64,74.61 60.64,54.61 59.06,53.02 59.06,36.2 59.69,35.56 59.69,24.77 58.74,23.81 58.74,22.54 v60.33,20.95
  Bottom 0.254: IC6.12 93.98,20.32 68.26,20.32 v67.31,21.27 60.64,21.27 v60.33,20.95 | v60.33,90.81 IC24.9
M1  (via drill 0.61)
  Top 0.254: IC12.3 73.03,51.44 73.03,54.93 72.39,55.56 72.39,99.38 73.66,100.65 IC24.3 | v82.23,19.37 82.55,19.68 82.55,27.62 80.01,30.16 80.01,30.8 82.55,33.34 82.55,40.32 81.92,40.96 v81.92,49.85
  Bottom 0.254: IC6.11 92.08,19.68 82.55,19.68 v82.23,19.37 | v81.92,49.85 81.6,49.53 74.93,49.53 IC12.3
M2  (via drill 0.61)
  Top 0.254: v85.41,18.1 84.14,19.37 v84.14,46.04 83.82,46.35 83.82,78.74 84.14,79.06 84.14,83.19 v83.19,84.14 | v71.44,46.35 71.12,46.04 IC12.11 | IC24.11 69.85,95.25 v69.85,86.68
  Bottom 0.254: IC6.10 90.17,19.05 86.36,19.05 v85.41,18.1 | v84.14,46.04 83.82,46.35 v71.44,46.35 | v69.85,86.68 70.8,85.72 80.33,85.72 81.92,84.14 v83.19,84.14
N1  (via drill 0.61)
  Top 0.254: IC24.5 67.31,102.87 67.31,55.56 68.26,54.61 68.26,51.12 IC12.5 68.58,47.31 v68.26,46.99 | IC6.9 88.58,18.1 v88.58,23.18 | v59.69,23.5 60.33,24.13 60.33,44.77 v60.01,45.09
  Bottom 0.254: v88.58,23.18 88.27,23.5 v59.69,23.5 | v60.01,45.09 61.91,46.99 v68.26,46.99
N2  (via drill 0.61)
  Top 0.254: IC6.7 90.17,26.67 v90.17,37.15 | v77.47,37.15 77.47,39.05 76.2,40.32 IC12.13 | IC24.13 74.93,95.25 74.93,74.3 v76.52,72.71 | v85.41,71.44 85.09,71.12 85.09,49.21 86.04,48.26 v86.04,37.15
  Bottom 0.254: v90.17,37.15 89.85,36.83 86.04,36.83 | 86.04,36.83 77.79,36.83 v77.47,37.15 | v76.52,72.71 76.84,73.03 83.82,73.03 v85.41,71.44 | 86.04,36.83 v86.04,37.15
N$1  (via drill 0.61)
  Top 0.254: IC20.6 66.04,15.24 v66.04,15.56 | v51.44,19.37 51.44,53.34 51.75,53.66 v51.75,63.18
  Bottom 0.254: v66.04,15.56 62.23,19.37 v51.44,19.37 | v51.75,63.18 51.44,63.5 QG1.8
OK1  (via drill 0.61)
  Top 0.254: v56.2,18.41 54.61,20 54.61,28.57 54.29,28.89 54.29,29.84 54.61,30.16 v54.61,56.2 | v42.86,58.74 43.18,59.05 IC15.19
  Bottom 0.254: IC20.1 80.01,13.97 62.23,13.97 57.79,18.41 v56.2,18.41 | v54.61,56.2 52.07,58.74 v42.86,58.74
OK2  (via drill 0.61)
  Top 0.254: IC20.2 83.19,17.14 v83.19,28.26 | v72.39,114.3 v72.39,127 | v44.77,107.95 41.91,105.09 41.91,86.04 43.18,84.77 IC16.19
  Bottom 0.254: v83.19,28.26 87.31,32.38 100.01,32.38 102.55,34.92 106.05,34.92 116.21,45.09 116.21,127 v72.39,127 | v72.39,114.3 71.76,113.67 61.91,113.67 57.15,108.9 57.15,107.95 v44.77,107.95
OK3  (via drill 0.61)
  Top 0.254: IC20.3 77.79,11.11 v86.04,11.11 | v111.44,15.56 112.4,16.51 112.4,64.77 v112.71,65.09 | v87.31,72.71 85.73,74.3 85.73,85.41 81.28,89.85 v81.28,97.79 | v45.09,87 44.45,87.63 44.45,95.25 IC17.19
  Bottom 0.254: v86.04,11.11 86.36,10.79 106.68,10.79 v111.44,15.56 | v112.71,65.09 105.09,72.71 v87.31,72.71 | v81.28,97.79 80.33,98.74 71.76,98.74 69.85,96.84 69.85,89.85 58.74,89.85 56.52,87.63 51.75,87.63 51.12,87 v45.09,87
OK4  (via drill 0.61)
  Top 0.254: IC20.4 80.01,6.35 86.68,6.35 86.68,4.76 88.27,3.17 95.25,3.17 95.25,5.4 96.2,6.35 105.41,6.35 105.41,4.76 106.36,3.81 108.59,3.81 108.59,121.28 103.19,126.68 93.35,126.68 93.35,118.11 92.08,116.84 v80.33,116.84 | v44.45,119.7 41.91,117.16 41.91,110.49 IC18.19
  Bottom 0.254: v80.33,116.84 79.06,118.11 51.44,118.11 49.85,119.7 v44.45,119.7
OK5  (via drill 0.61)
  Top 0.254: IC20.5 72.39,13.97 72.39,27.62 74.93,30.16 v74.93,34.29 | v115.25,125.73 109.54,131.44 67.31,131.44 v67.31,127
  Bottom 0.254: v74.93,34.29 76.2,35.56 105.73,35.56 115.57,45.4 115.57,125.73 v115.25,125.73 | v67.31,127 65.41,125.09 60.96,125.09 56.52,120.65 44.45,120.65 IC19.19
P1  (via drill 0.61)
  Top 0.254: IC13.1 36.83,49.53 v36.83,44.13 | IC25.1 81.28,114.3 96.2,114.3 96.2,124.78 96.84,125.41 103.51,125.41 103.51,53.02 105.41,51.12 105.41,44.45 IC7.15
  Bottom 0.254: v36.83,44.13 37.15,44.45 57.47,44.45 57.79,44.13 62.87,44.13 63.18,44.45 88.58,44.45 90.17,46.04 101.28,46.04 IC7.15
P2  (via drill 0.61)
  Top 0.254: IC13.9 28.26,46.04 v28.26,49.21 | v56.52,75.25 v56.52,68.9 v56.52,50.8 | v64.45,77.15 64.77,77.47 64.77,104.46 66.04,105.73 IC25.9 | IC7.14 102.24,43.81 102.24,49.85 102.87,50.48 102.87,61.28 v101.28,62.87
  Bottom 0.254: v28.26,49.21 28.58,49.53 55.25,49.53 v56.52,50.8 | v56.52,75.25 58.42,77.15 v64.45,77.15 | v101.28,62.87 96.2,67.94 69.53,67.94 68.58,68.9 v56.52,68.9
PA1  (via drill 0.61)
  Top 0.254: SV1.36 v55.88,76.83
  Bottom 0.254: IC15.2 45.09,76.83 v55.88,76.83
PA2  (via drill 0.61)
  Top 0.254: IC15.4 38.42,79.06 v38.42,81.28
  Bottom 0.254: SV1.35 v38.42,81.28
PB1  (via drill 0.61)
  Top 0.254: IC15.6 33.34,79.06 v33.34,81.28
  Bottom 0.254: v33.34,81.28 33.97,81.92 37.78,81.92 38.1,82.23 42.23,82.23 42.55,81.92 52.07,81.92 52.71,82.55 54.61,82.55 SV1.34
PB2  (via drill 0.61)
  Top 0.254: v50.17,80.33 50.48,80.64 v50.48,82.87
  Bottom 0.254: IC15.8 29.53,80.33 42.23,80.33 42.55,80.64 49.85,80.64 v50.17,80.33 | v50.48,82.87 51.44,83.82 SV1.33
PC1  (via drill 0.61)
  Top 0.254: v48.26,85.09 v48.26,66.99
  Bottom 0.254: IC15.11 26.99,66.99 v48.26,66.99 | v48.26,85.09 54.61,85.09 SV1.32
PC2  (via drill 0.61)
  Top 0.254: v49.21,86.04 v49.21,69.22
  Bottom 0.254: IC15.13 29.85,69.22 v49.21,69.22 | v49.21,86.04 49.53,86.36 SV1.31
PD1  (via drill 0.61)
  Top 0.254: v57.47,70.8 57.47,81.92 57.79,82.23 57.79,87 SV1.30
  Bottom 0.254: IC15.15 34.29,69.85 48.58,69.85 49.53,70.8 v57.47,70.8
PD2  (via drill 0.61)
  Top 0.254: v50.17,73.34 51.44,74.61 51.44,87 SV1.29
  Bottom 0.254: IC15.17 40.32,73.34 v50.17,73.34
PE1
  Bottom 0.254: IC16.2 44.45,90.17 54.61,90.17 SV1.28
PE2
  Bottom 0.254: IC16.4 39.37,92.71 51.75,92.71 53.02,91.44 SV1.27
PF1
  Bottom 0.254: IC16.6 34.93,93.34 52.07,93.34 52.71,92.71 54.61,92.71 SV1.26
PF2
  Bottom 0.254: IC16.8 30.48,93.98 SV1.25
PH1  (via drill 0.61)
  Top 0.254: IC16.11 26.67,80.01 v26.67,77.15 | v58.42,74.3 58.42,93.98 SV1.24
  Bottom 0.254: v26.67,77.15 27.94,75.88 38.74,75.88 40.32,74.3 v58.42,74.3
PH2  (via drill 0.61)
  Top 0.254: IC16.13 28.26,84.14 v28.26,88.58 | v50.8,87.95 52.07,89.22 52.07,89.53 52.71,90.17 54.61,90.17 54.61,95.25 SV1.23
  Bottom 0.254: v28.26,88.58 32.07,88.58 33.02,87.63 39.69,87.63 40.01,87.95 48.9,87.95 49.21,87.63 50.48,87.63 v50.8,87.95
PJ1  (via drill 0.61)
  Top 0.254: IC16.15 33.34,84.14 v33.34,88.58 | v49.53,88.58 49.85,88.9 49.85,97.47 52.71,100.33 55.88,100.33 SV1.22
  Bottom 0.254: v49.53,88.58 v33.34,88.58
PJ2  (via drill 0.61)
  Top 0.254: IC16.17 38.42,84.14 v38.42,89.53 | v50.8,89.22 52.07,90.49 52.07,97.79 SV1.21
  Bottom 0.254: v38.42,89.53 50.48,89.53 v50.8,89.22
PK1  (via drill 0.61)
  Top 0.254: IC17.2 44.77,102.55 v44.77,100.65
  Bottom 0.254: v44.77,100.65 45.09,100.33 54.61,100.33 SV1.20
PK2  (via drill 0.61)
  Top 0.254: v40.64,101.6 IC17.4
  Bottom 0.254: SV1.19 v40.64,101.6
PL1
  Bottom 0.254: IC17.6 34.29,102.87 54.61,102.87 SV1.18
PL2
  Bottom 0.254: IC17.8 29.85,106.05 51.44,106.05 SV1.17
PM1
  Bottom 0.254: IC17.11 24.13,95.25 33.34,95.25 33.97,94.61 49.53,94.61 52.71,97.79 56.52,97.79 57.15,98.42 57.15,106.68 SV1.16
PM2  (via drill 0.61)
  Top 0.254: IC17.13 29.21,97.79 v29.21,106.68
  Bottom 0.254: SV1.15 v29.21,106.68
PN1  (via drill 0.61)
  Top 0.254: v33.02,99.38 IC17.15 | v48.58,99.38 51.44,102.23 51.44,108.58 52.07,109.22 52.07,109.86 52.71,110.49 55.88,110.49 SV1.14
  Bottom 0.254: v33.02,99.38 46.04,99.38 46.36,99.69 48.26,99.69 v48.58,99.38
PN2  (via drill 0.61)
  Top 0.254: v50.17,99.38 52.07,101.28 52.07,107.95 SV1.13
  Bottom 0.254: IC17.17 39.37,95.25 46.04,95.25 v50.17,99.38
PP1  (via drill 0.61)
  Top 0.254: IC18.2 45.4,114.62 v45.4,113.67
  Bottom 0.254: v45.4,113.67 46.04,113.03 54.61,113.03 SV1.12
PP2  (via drill 0.61)
  Top 0.254: IC18.4 38.74,116.2 v38.74,112.71
  Bottom 0.254: v38.74,112.71 39.05,112.39 52.71,112.39 SV1.11
PR1
  Bottom 0.254: IC18.6 34.29,115.57 54.61,115.57 SV1.10
PR2  (via drill 0.61)
  Top 0.254: v49.53,118.75 49.85,118.43 49.85,111.12 50.48,110.49 51.75,110.49 51.75,112.71 SV1.9
  Bottom 0.254: IC18.8 29.85,118.75 v49.53,118.75
PS1  (via drill 0.61)
  Top 0.254: IC18.11 26.67,113.03 26.67,122.24 v31.75,127.32 | v56.2,127.64 57.15,126.68 57.15,118.11 SV1.8
  Bottom 0.254: v31.75,127.32 32.39,127.95 41.28,127.95 41.59,127.64 v56.2,127.64
PS2  (via drill 0.61)
  Top 0.254: IC18.13 29.53,110.81 v29.53,114.3
  Bottom 0.254: v29.53,114.3 31.75,116.52 31.75,118.11 48.9,118.11 50.17,116.84 SV1.7
PT1  (via drill 0.61)
  Top 0.254: IC18.15 35.88,112.08 v35.88,114.62 | v51.75,114.62 52.71,115.57 54.61,115.57 54.61,118.11 SV1.6
  Bottom 0.254: v51.75,114.62 v35.88,114.62
PT2  (via drill 0.61)
  Top 0.254: v50.8,111.44 50.8,116.84 SV1.5
  Bottom 0.254: IC18.17 40.32,111.44 v50.8,111.44
PU1
  Bottom 0.254: IC19.2 44.45,128.27 55.56,128.27 55.88,128.59 56.52,128.59 57.15,127.95 57.15,122.24 56.2,122.24 SV1.4
PU2
  Top 0.254: IC19.4 39.37,130.81 52.07,130.81 52.07,123.19 SV1.3
PV1  (via drill 0.61)
  Top 0.254: IC19.6 34.61,127.95 v34.61,127
  Bottom 0.254: v34.61,127 53.34,127 SV1.2
PV2
  Bottom 0.254: IC19.8 29.21,130.81 30.8,130.81 31.75,129.86 31.75,128.27 31.43,128.27 30.8,127.64 30.8,126.05 34.93,126.05 35.24,126.36 51.44,126.36 SV1.1
R1  (via drill 0.61)
  Top 0.254: v50.8,53.98 50.8,66.36 v53.34,68.9 | IC7.13 99.06,49.21 100.33,50.48 100.33,67.31 v99.06,68.58 99.06,120.97 v98.11,121.92 | IC25.3 74.3,117.47 74.3,120.97 74.93,121.6 74.93,122.24 75.88,123.19 87.63,123.19 v87.63,122.24
  Bottom 0.254: IC13.3 35.24,53.02 49.85,53.02 v50.8,53.98 | v53.34,68.9 54.29,69.85 72.39,69.85 73.66,68.58 v99.06,68.58 | v87.63,122.24 87.95,121.92 v98.11,121.92
R2  (via drill 0.61)
  Top 0.254: IC25.11 74.93,105.41 v74.93,105.09 | v98.11,104.14 98.11,51.44 97.79,51.12 97.79,44.45 IC7.12
  Bottom 0.254: IC13.11 31.75,41.91 95.25,41.91 IC7.12 | v74.93,105.09 75.25,105.41 87,105.41 88.27,104.14 v98.11,104.14
S1  (via drill 0.61)
  Top 0.254: v45.4,53.98 47.31,55.88 v47.31,67.94 47.31,77.79 47.63,78.11 47.63,84.45 47.31,84.77 47.31,90.49 47.63,90.81 47.63,106.05 v51.12,109.54 | v90.49,45.09 90.17,45.4 v90.17,66.36
  Bottom 0.254: IC13.5 31.12,53.98 v45.4,53.98 | v51.12,109.54 52.07,110.49 57.79,110.49 62.87,115.57 67.31,115.57 IC25.5 | IC7.11 92.08,45.09 v90.49,45.09 | v90.17,66.36 89.22,67.31 69.22,67.31 68.58,67.94 v47.31,67.94
S2  (via drill 0.61)
  Top 0.254: v58.1,45.09 v58.1,48.58 58.1,53.02 59.69,54.61 v59.69,74.3 | v91.12,49.21 91.44,48.9 IC7.10 | v63.5,105.73 61.6,103.82 v61.6,76.2
  Bottom 0.254: IC13.13 35.56,45.09 v58.1,45.09 | v58.1,48.58 58.42,48.9 84.14,48.9 84.46,49.21 v91.12,49.21 | IC25.13 74.93,107.95 68.26,107.95 66.04,105.73 v63.5,105.73 | v59.69,74.3 v61.6,76.2
SEL0  (via drill 0.61)
  Top 0.254: v72.07,34.29 73.03,35.24 73.03,37.47 IC4.4
  Bottom 0.254: IC3.4 46.99,34.29 v72.07,34.29
SEL1  (via drill 0.61)
  Top 0.254: v42.86,9.84 v42.86,30.16 | IC5.4 v94.62,8.26
  Bottom 0.254: IC3.5 45.4,30.16 v42.86,30.16 | v42.86,9.84 43.82,8.89 87,8.89 87.63,8.26 v94.62,8.26
SEL2  (via drill 0.61)
  Top 0.254: IC6.4 v94.62,20.95
  Bottom 0.254: IC3.6 45.09,27.3 38.42,27.3 36.83,25.72 36.83,21.59 59.69,21.59 60.01,21.91 66.68,21.91 66.99,22.23 87.31,22.23 88.58,20.95 v94.62,20.95
SEL3  (via drill 0.61)
  Top 0.254: v50.48,52.39 v50.48,25.72
  Bottom 0.254: IC3.7 46.04,25.72 v50.48,25.72 | v50.48,52.39 50.8,52.7 75.57,52.7 75.88,52.39 76.84,52.39 77.79,53.34 96.52,53.34 IC7.4
SEL4  (via drill 0.61)
  Top 0.254: v96.2,33.34 99.06,36.2 IC8.4
  Bottom 0.254: IC3.12 53.66,30.8 55.88,30.8 56.83,31.75 56.83,33.34 v96.2,33.34
T1  (via drill 0.61)
  Top 0.254: IC14.1 39.05,62.55 v39.05,61.28 | v82.87,60.96 83.19,60.64 v83.19,43.5 | IC26.1 109.54,129.54 v109.54,87
  Bottom 0.254: v39.05,61.28 39.37,60.96 v82.87,60.96 114.94,60.96 114.94,81.6 v109.54,87 | v83.19,43.5 83.5,43.18 IC7.9
T2  (via drill 0.61)
  Top 0.254: IC14.9 28.26,58.74 v28.26,59.05 | v91.12,62.87 91.44,62.55 IC7.7 | v97.16,65.72 v97.16,124.46
  Bottom 0.254: v28.26,59.05 30.8,61.59 38.1,61.59 39.37,62.87 44.77,62.87 45.4,62.23 81.92,62.23 82.55,62.87 v91.12,62.87 94.3,62.87 v97.16,65.72 | IC26.9 64.77,120.65 63.18,120.65 62.23,121.6 62.23,124.46 v97.16,124.46
TA1  (via drill 0.61)
  Top 0.254: v86.04,64.45 86.36,64.77 86.36,70.48 91.44,75.56 SV2.36
  Bottom 0.254: IC21.2 77.47,64.77 85.73,64.77 v86.04,64.45
TA2  (via drill 0.61)
  Top 0.254: v61.6,74.93 v61.6,57.78 | v86.68,75.25 88.9,77.47 SV2.35
  Bottom 0.254: v61.6,57.78 IC21.8 | v61.6,74.93 61.91,75.25 67.95,75.25 68.26,75.56 86.36,75.56 v86.68,75.25
TB1  (via drill 0.61)
  Top 0.254: IC21.4 71.44,63.82 v71.44,66.36 | v88.27,66.36 92.71,70.8 92.71,81.28 SV2.34
  Bottom 0.254: v88.27,66.36 v71.44,66.36
TB2  (via drill 0.61)
  Top 0.254: v82.23,59.05 81.92,59.37 81.92,74.93 83.19,76.2 v83.19,82.87
  Bottom 0.254: IC21.10 71.76,59.05 v82.23,59.05 | v83.19,82.87 83.5,82.55 SV2.33
TC1  (via drill 0.61)
  Top 0.254: v91.12,65.41 94.93,69.22 v94.93,85.09
  Bottom 0.254: IC21.6 67.95,65.41 v91.12,65.41 | SV2.32 v94.93,85.09
TC2  (via drill 0.61)
  Top 0.254: v81.6,57.78 81.28,58.1 81.28,75.25 82.23,76.2 v82.23,85.09
  Bottom 0.254: IC21.12 75.57,57.78 v81.6,57.78 | SV2.31 v82.23,85.09
TD1  (via drill 0.61)
  Top 0.254: IC22.2 76.52,79.06 v76.52,80.96
  Bottom 0.254: v76.52,80.96 76.84,80.64 86.36,80.64 88.27,78.74 92.08,78.74 95.89,82.55 95.89,87.63 SV2.30
TD2  (via drill 0.61)
  Top 0.254: IC22.8 64.14,71.75 64.14,73.98 v66.36,76.2 | v88.58,75.88 90.17,77.47 90.17,86.36 SV2.29
  Bottom 0.254: v66.36,76.2 88.27,76.2 v88.58,75.88
TE1
  Bottom 0.254: IC22.4 69.85,77.47 68.26,77.47 67.31,78.42 67.31,80.01 69.85,80.01 71.76,81.92 87.63,81.92 88.27,81.28 89.54,81.28 90.17,81.92 90.17,90.17 SV2.28
TE2  (via drill 0.61)
  Top 0.254: v68.58,74.61 IC22.10 | v79.69,74.61 81.28,76.2 v81.28,88.58
  Bottom 0.254: v79.69,74.61 v68.58,74.61 | v81.28,88.58 82.87,90.17 SV2.27
TF1  (via drill 0.61)
  Top 0.254: v93.98,76.83 93.35,77.47 93.35,90.81 SV2.26
  Bottom 0.254: IC22.6 67.95,76.83 v93.98,76.83
TF2
  Bottom 0.254: IC22.12 76.2,73.66 106.68,73.66 111.44,78.42 111.44,84.14 101.92,84.14 92.08,93.98 90.81,93.98 89.54,92.71 SV2.25
TH1
  Bottom 0.254: IC23.2 78.74,93.98 89.85,93.98 91.12,95.25 SV2.24
TH2
  Bottom 0.254: IC23.8 68.26,88.58 72.39,88.58 74.93,91.12 74.93,94.3 78.11,94.3 78.42,94.61 88.27,94.61 SV2.23
TJ1
  Bottom 0.254: IC23.4 74.93,95.25 87,95.25 88.27,96.52 90.17,96.52 SV2.22
TJ2  (via drill 0.61)
  Top 0.254: v86.68,87.63 87.63,88.58 87.63,96.52 SV2.21
  Bottom 0.254: IC23.10 68.58,87.63 v86.68,87.63
TK1
  Bottom 0.254: IC23.6 66.04,95.25 66.36,95.25 67.31,96.2 67.31,99.38 87.95,99.38 88.27,99.06 90.17,99.06 SV2.20
TK2  (via drill 0.61)
  Top 0.254: IC23.12 73.98,84.14 v73.98,86.68 | v85.73,86.68 85.73,97.16 SV2.19
  Bottom 0.254: v85.73,86.68 v73.98,86.68
TL1  (via drill 0.61)
  Top 0.254: IC24.2 77.15,103.19 v77.15,101.92
  Bottom 0.254: v77.15,101.92 77.47,101.6 90.17,101.6 SV2.18
TL2
  Bottom 0.254: IC24.8 69.85,102.87 SV2.17
TM1
  Bottom 0.254: IC24.4 71.12,106.68 90.17,106.68 SV2.16
TM2  (via drill 0.61)
  Top 0.254: IC24.10 72.39,100.33 v72.39,105.09
  Bottom 0.254: v72.39,105.09 73.34,106.05 88.27,106.05 SV2.15
TN1
  Bottom 0.254: IC24.6 69.22,107.31 86.36,107.31 88.27,109.22 90.17,109.22 SV2.14
TN2  (via drill 0.61)
  Top 0.254: v80.01,97.79 87.63,105.41 87.63,106.68 SV2.13
  Bottom 0.254: IC24.12 74.93,97.79 v80.01,97.79
TP1  (via drill 0.61)
  Top 0.254: IC25.2 77.79,115.25 v77.79,112.08
  Bottom 0.254: v77.79,112.08 78.11,111.76 90.17,111.76 SV2.12
TP2
  Bottom 0.254: IC25.8 64.77,110.49 SV2.11
TR1
  Bottom 0.254: IC25.4 73.98,113.98 87.95,113.98 88.27,114.3 90.17,114.3 SV2.10
TR2
  Bottom 0.254: IC25.10 67.31,107.95 63.18,107.95 62.23,108.9 62.23,113.03 SV2.9
TS1  (via drill 0.61)
  Top 0.254: v68.26,119.06 IC25.6
  Bottom 0.254: v68.26,119.06 68.58,118.75 86.36,118.75 88.27,116.84 90.17,116.84 SV2.8
TS2  (via drill 0.61)
  Top 0.254: IC25.12 75.25,110.81 v75.25,114.94
  Bottom 0.254: v75.25,114.94 88.27,114.94 SV2.7
TT1
  Top 0.254: IC26.2 80.65,125.09 92.71,125.09 92.71,119.38 SV2.6
TT2
  Bottom 0.254: IC26.8 64.77,123.19 66.36,123.19 67.31,122.24 67.31,120.02 87,120.02 SV2.5
TU1
  Top 0.254: IC26.4 76.2,124.46 90.17,124.46 90.17,121.92 SV2.4
TU2
  Bottom 0.254: IC26.10 69.85,120.65 SV2.3
TV1
  Bottom 0.254: IC26.6 69.53,126.05 97.47,126.05 98.11,125.41 98.11,123.19 SV2.2
TV2
  Bottom 0.254: IC26.12 74.93,123.19 SV2.1
U1  (via drill 0.61)
  Top 0.254: v23.18,66.36 19.69,69.85 19.69,86.04 18.42,87.31 18.42,98.42 20.96,100.97 v20.96,129.22
  Bottom 0.254: IC14.3 33.02,66.36 v23.18,66.36 | v20.96,129.22 23.18,131.44 71.76,131.44 72.39,130.81 | IC26.3 72.39,130.81 | IC8.15 106.68,33.02 107.63,33.02 117.48,42.86 117.48,130.81 72.39,130.81
U2  (via drill 0.61)
  Top 0.254: IC14.11 31.12,56.52 31.12,62.55 31.75,63.18 31.75,68.26 34.29,70.8 34.29,73.34 39.37,78.42 v39.37,97.47 | v46.67,98.74 46.99,99.06 46.99,115.57 48.58,117.16 48.58,119.06 50.17,120.65 54.61,120.65 54.61,127.32 58.1,130.81 64.77,130.81 64.77,128.27 68.26,124.78 | IC26.11 68.26,124.78 | 68.26,124.78 v71.44,127.95
  Bottom 0.254: v39.37,97.47 40.64,98.74 v46.67,98.74 | IC8.14 104.78,33.66 107.32,33.66 116.84,43.18 116.84,127.95 v71.44,127.95
V1  (via drill 0.61)
  Top 0.254: IC14.5 29.21,64.77 29.21,93.66 31.75,96.2 31.75,106.36 34.29,108.9 34.29,109.54 36.83,112.08 36.83,123.51 v41.91,128.59 | v111.44,39.05 111.44,128.59 109.22,130.81 68.58,130.81 IC26.5
  Bottom 0.254: v41.91,128.59 41.91,130.81 67.31,130.81 IC26.5 | IC8.13 102.87,34.29 106.68,34.29 v111.44,39.05
V2  (via drill 0.61)
  Top 0.254: IC8.12 95.25,31.75 95.25,51.44 v92.39,54.29 96.2,58.1 96.2,66.04 96.52,66.36 96.52,109.22 v87,109.22 | IC26.13 74.93,120.65 74.93,116.52 76.84,114.62 76.84,110.17 77.47,109.54 v77.47,108.27
  Bottom 0.254: IC14.13 39.37,59.69 63.82,59.69 67.31,56.2 67.31,54.29 v92.39,54.29 | v77.47,108.27 77.79,107.95 85.73,107.95 v87,109.22
VCC  (via drill 0.61)
  Top 0.254: IC20.12 IC20.11 | IC5.16 107.95,6.35 107.95,16.51 | IC6.16 107.95,16.51 | 107.95,29.21 IC8.16 | 107.95,16.51 107.95,29.21 | IC7.16 107.95,41.91 107.95,29.21 | 80.01,85.09 IC23.14 | 80.01,85.09 80.01,95.25 IC24.14 78.74,97.79 80.01,99.06 80.01,107.95 IC25.14 78.74,115.25 77.47,116.52 77.47,120.65 IC26.14 | 80.01,85.09 80.01,78.42 78.74,77.15 IC22.14 80.65,69.22 80.65,56.83 v80.96,56.52 v80.96,43.5 | v47.63,40.96 45.72,42.86 QG1.14 44.45,49.53 44.45,63.82 45.72,65.09 IC15.20 46.67,72.07 46.67,73.03 | v78.74,40.96 IC12.14 | IC4.16 83.19,32.38 v83.19,40.96 | IC19.20 46.99,120.65 46.99,116.52 46.36,115.89 46.36,109.86 IC18.20 45.72,105.73 44.45,104.46 44.45,103.82 45.72,102.55 IC17.20 46.99,95.25 46.99,91.12 46.04,90.17 46.04,83.5 | 46.67,73.03 46.67,78.11 46.99,78.42 46.99,82.55 46.04,83.5 | 46.04,83.5 IC16.20 | IC9.14 39.37,6.35 39.37,16.51 | IC10.14 39.37,16.51 | IC2.5 46.67,16.83 v46.67,17.46 | 39.37,16.51 39.37,29.21 IC11.14 36.83,31.75 36.83,41.91 IC13.14 39.37,44.45 39.37,54.61 IC14.14 38.1,59.05 41.91,62.87 41.91,71.44 42.55,72.07 42.55,73.03 46.67,73.03
  Bottom 0.254: IC20.12 77.47,6.35 80.01,6.35 IC20.14 83.19,6.99 104.78,6.99 IC5.16 | IC21.14 79.38,56.52 v80.96,56.52 | IC1.5 73.66,27.94 78.74,27.94 IC4.16 | v47.63,40.96 53.02,40.96 IC3.16 53.98,41.27 78.42,41.27 | 78.42,41.27 82.87,41.27 v83.19,40.96 104.46,40.96 IC7.16 | 78.42,41.27 v78.74,40.96 | v46.67,17.46 46.36,17.78 IC10.14 | v80.96,43.5 80.65,43.18 IC12.14
XMIT
  Top 0.254: IC20.8 68.58,2.54 72.39,2.54 72.39,13.02 73.66,14.29 74.93,14.29 | 74.93,14.29 79.38,14.29 79.38,15.88 IC1.14 | 92.71,13.97 IC5.6 | 92.71,13.97 92.71,24.13 IC6.6 92.71,26.67 92.71,39.37 | IC7.6 92.71,49.53 92.71,39.37 | IC8.6 92.71,39.37 | 74.93,14.29 74.93,12.38 80.33,6.99 87.31,6.99 87.31,5.08 88.58,3.81 92.71,3.81 92.71,13.97
  Bottom 0.254: IC4.6 70.49,36.2 92.08,36.2 IC8.6